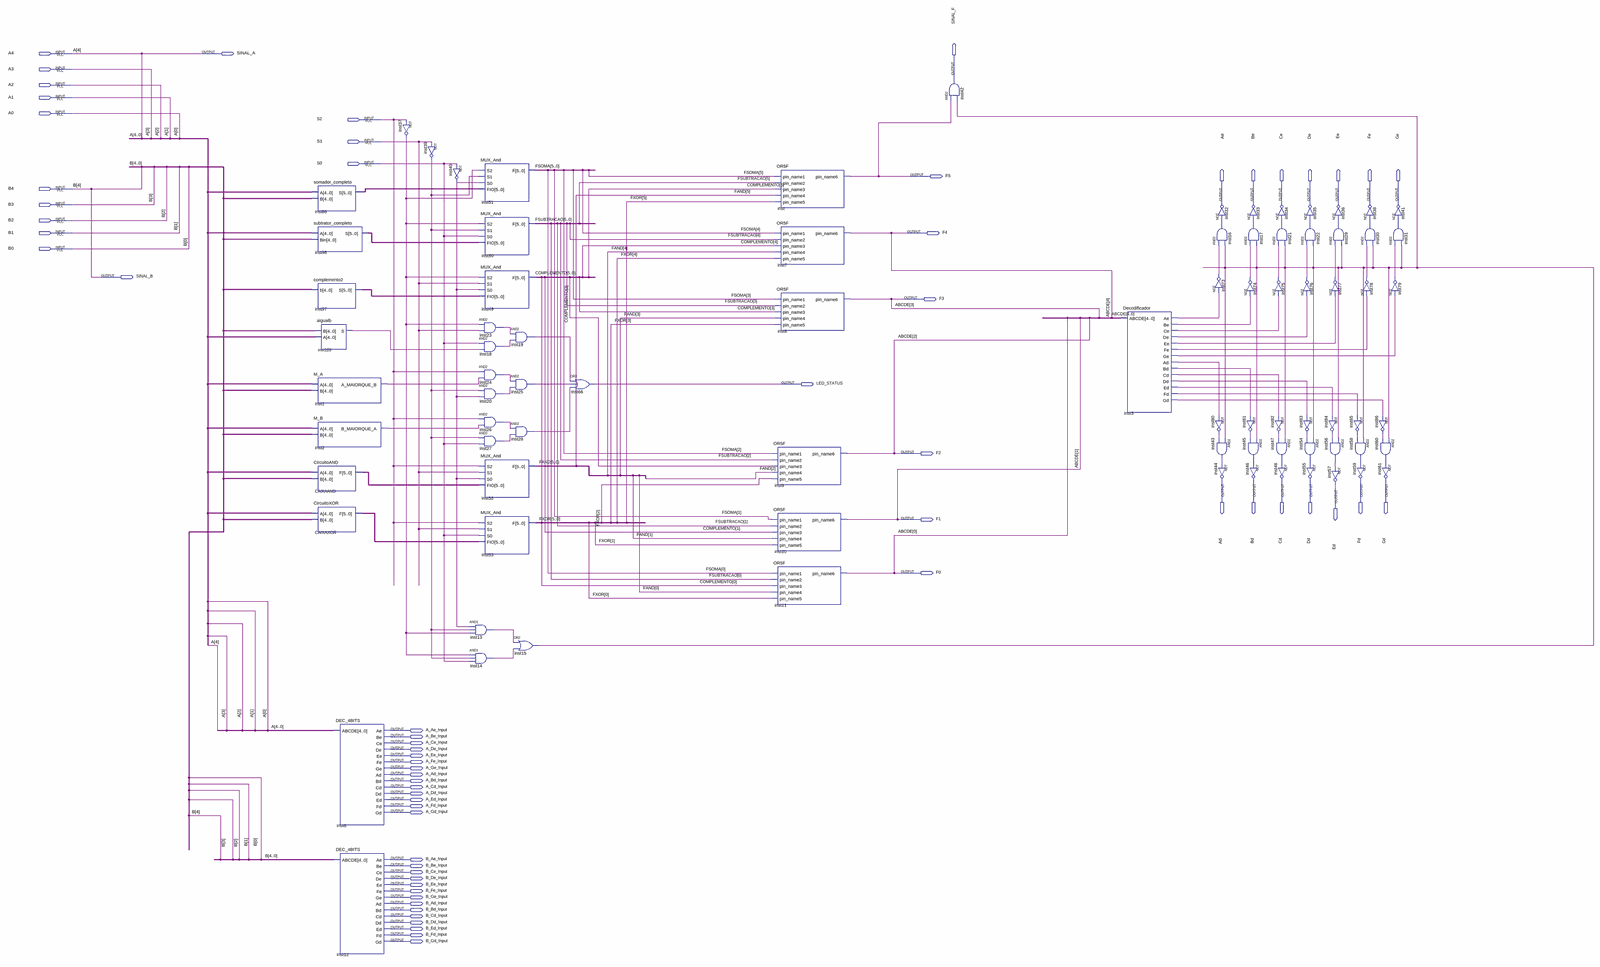
[diagram p0: schematic sheet, whole]
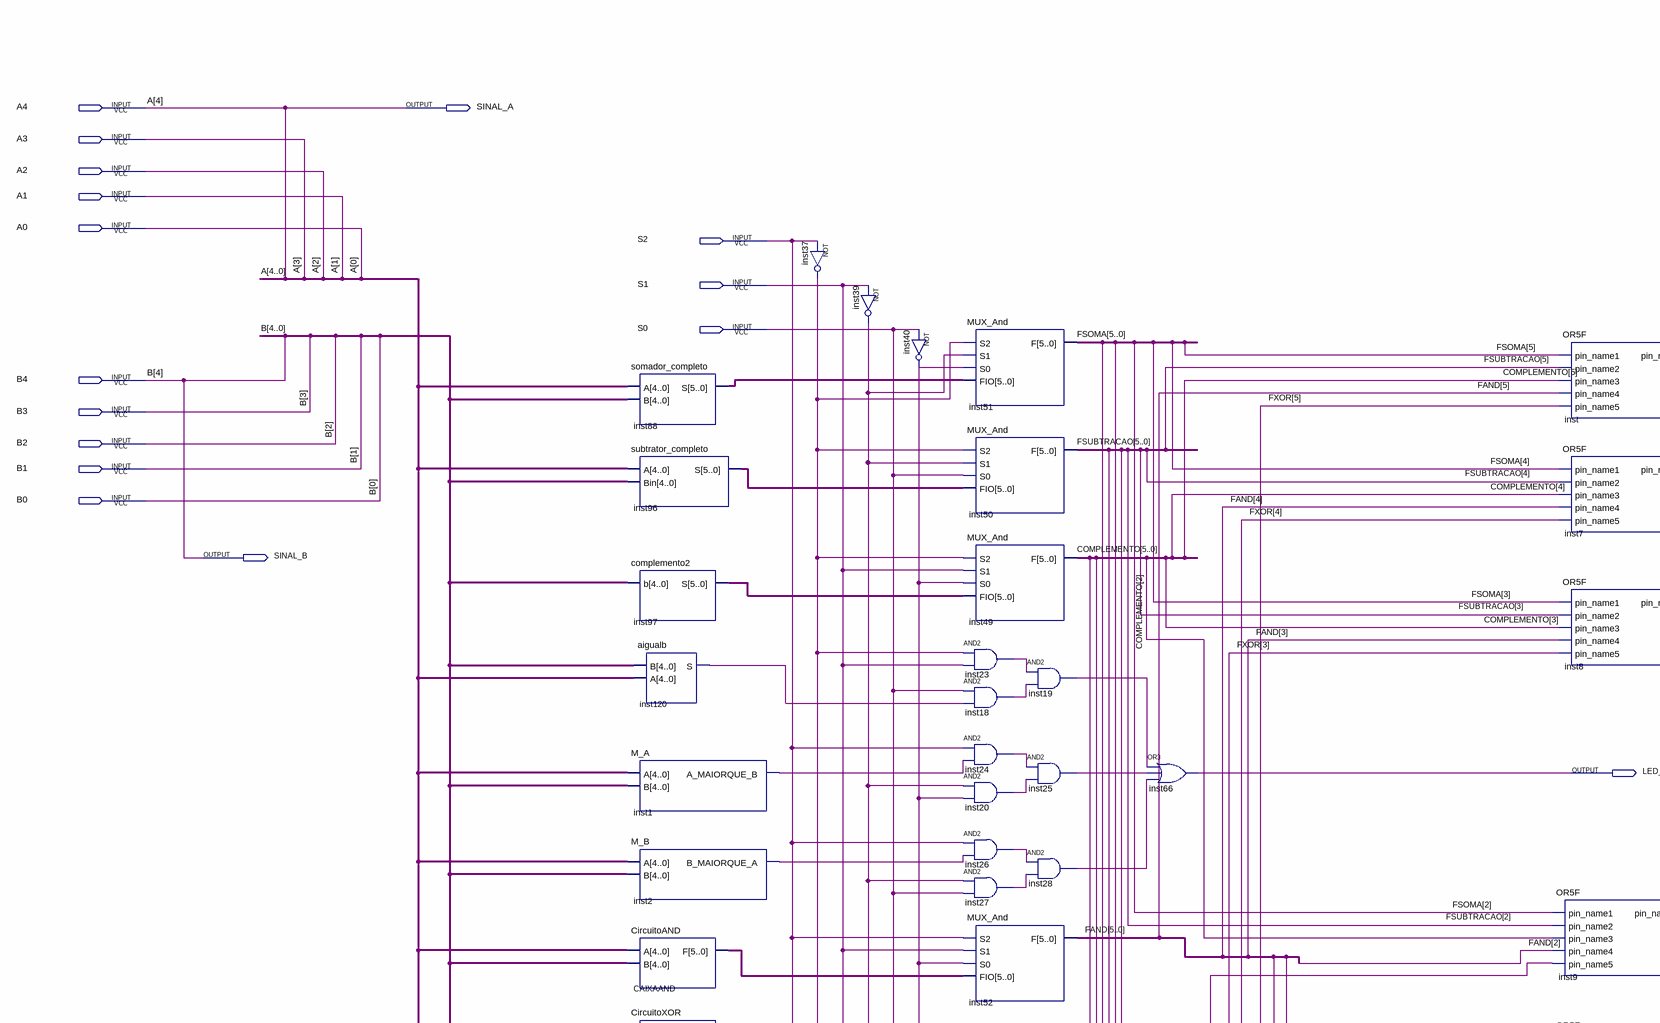
[diagram p1: schematic sheet, upper left part]
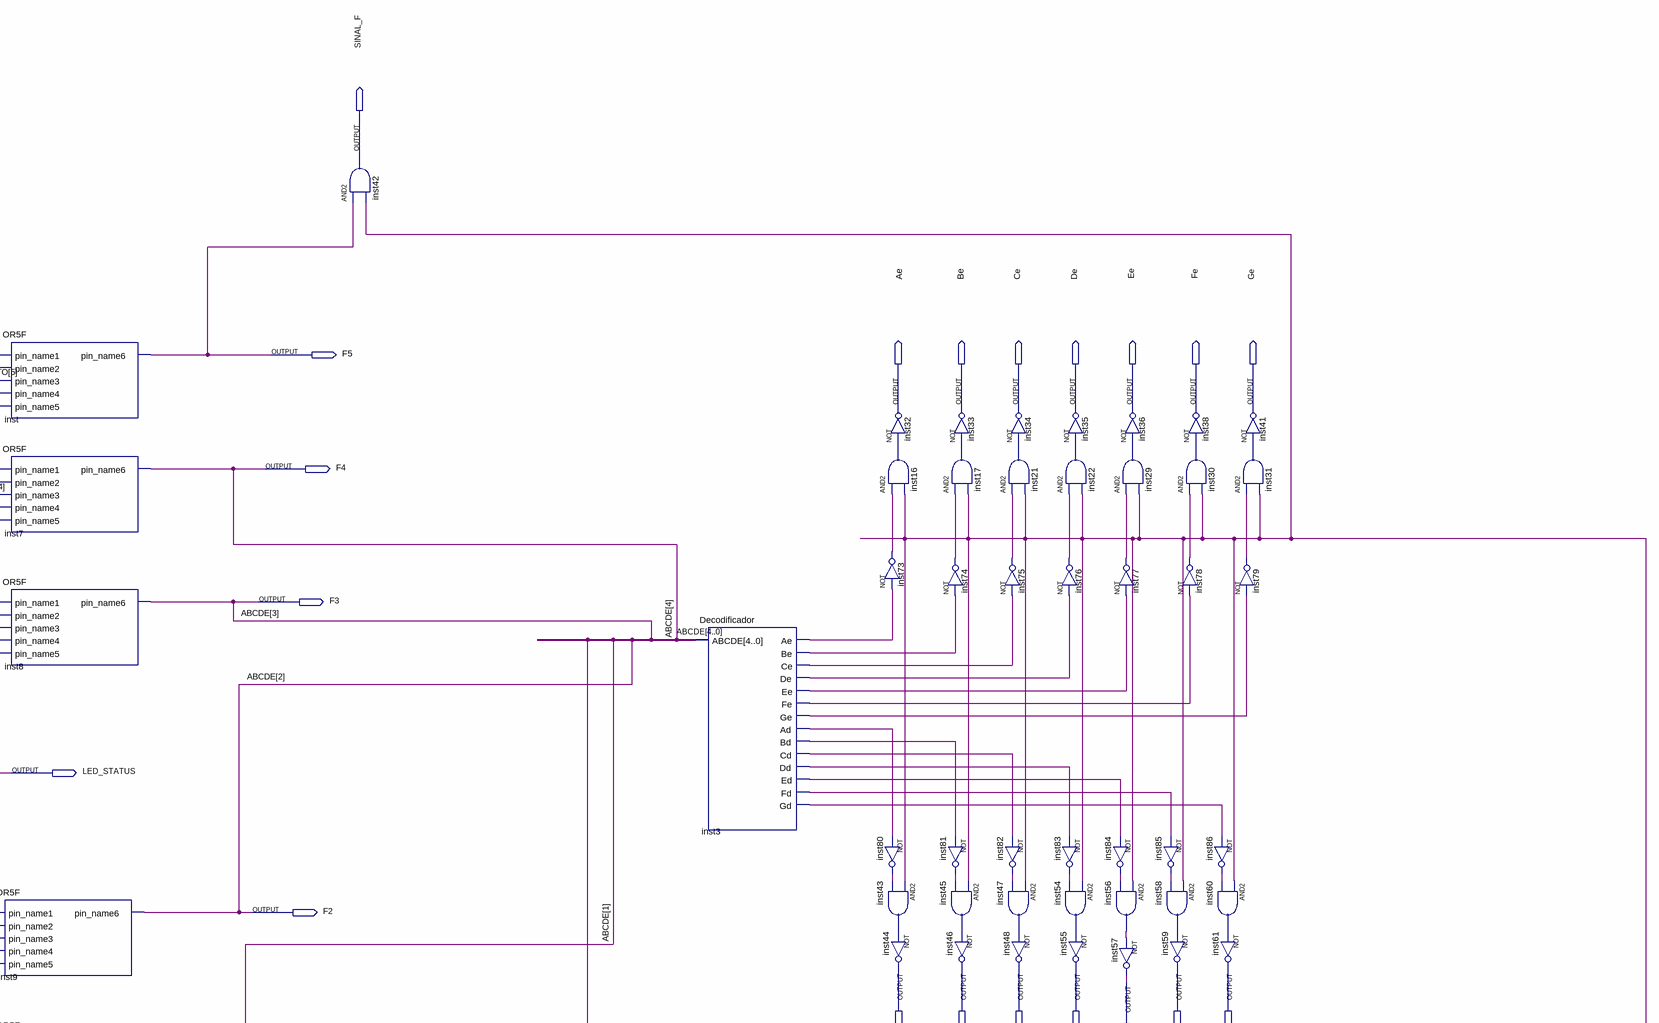
[diagram p2: schematic sheet, upper right part]
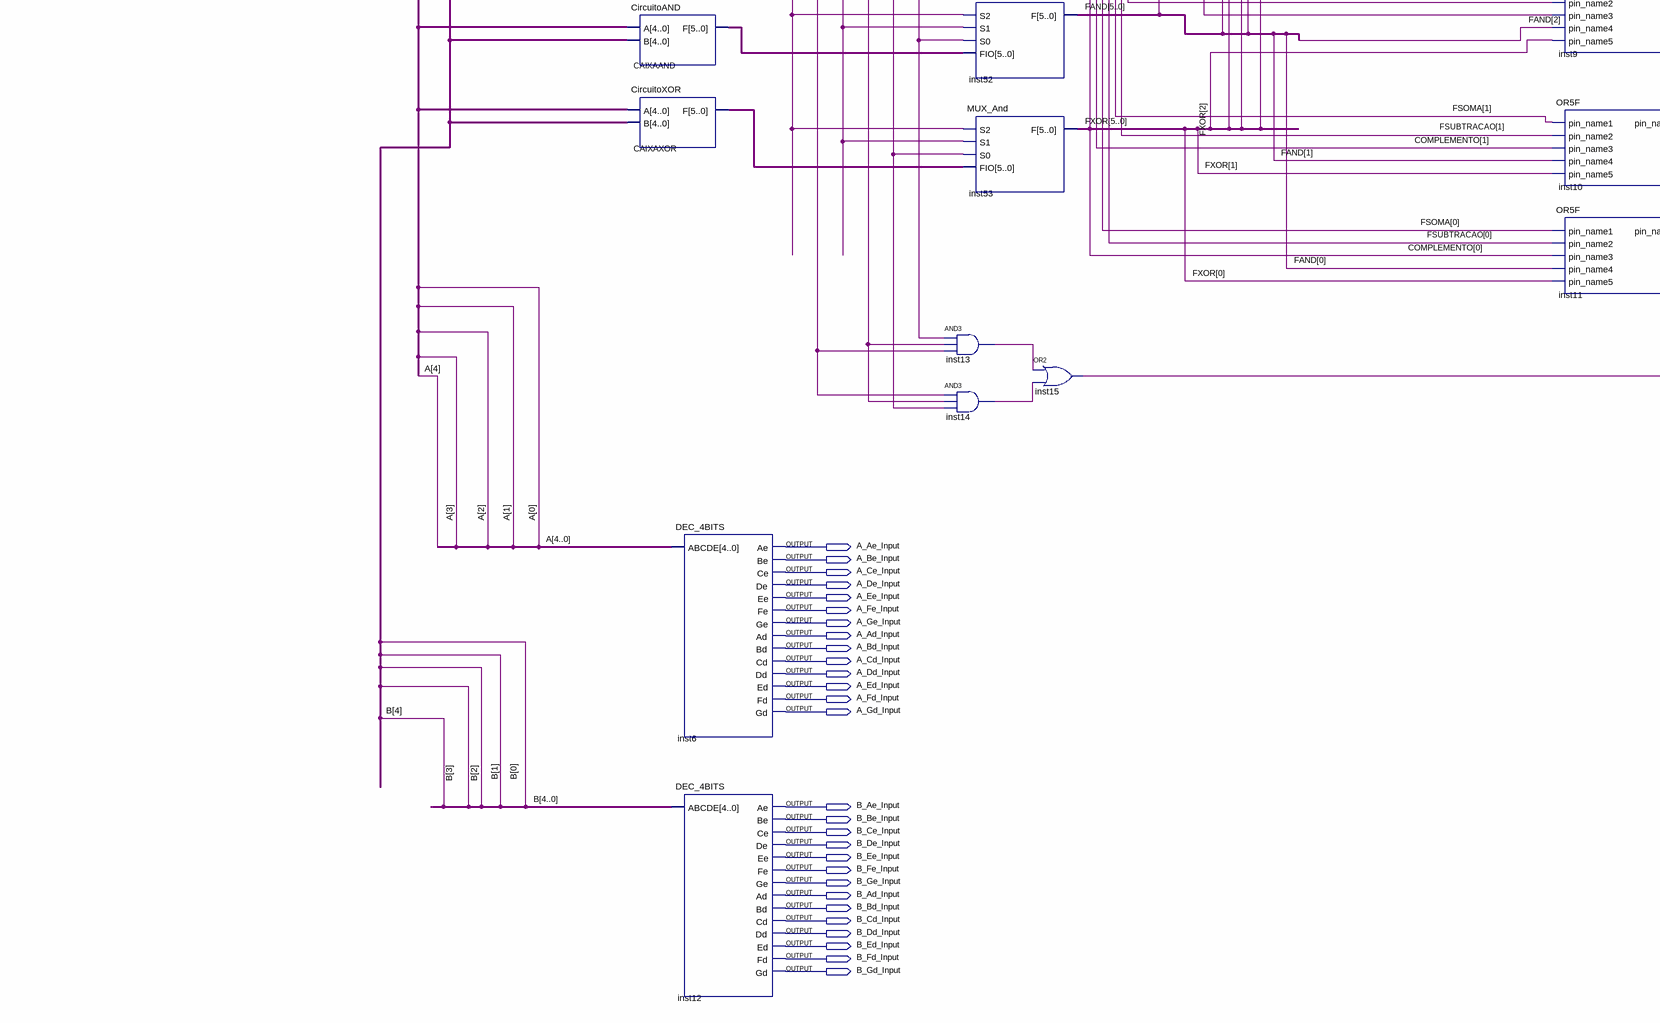
[diagram p3: schematic sheet, lower left part]
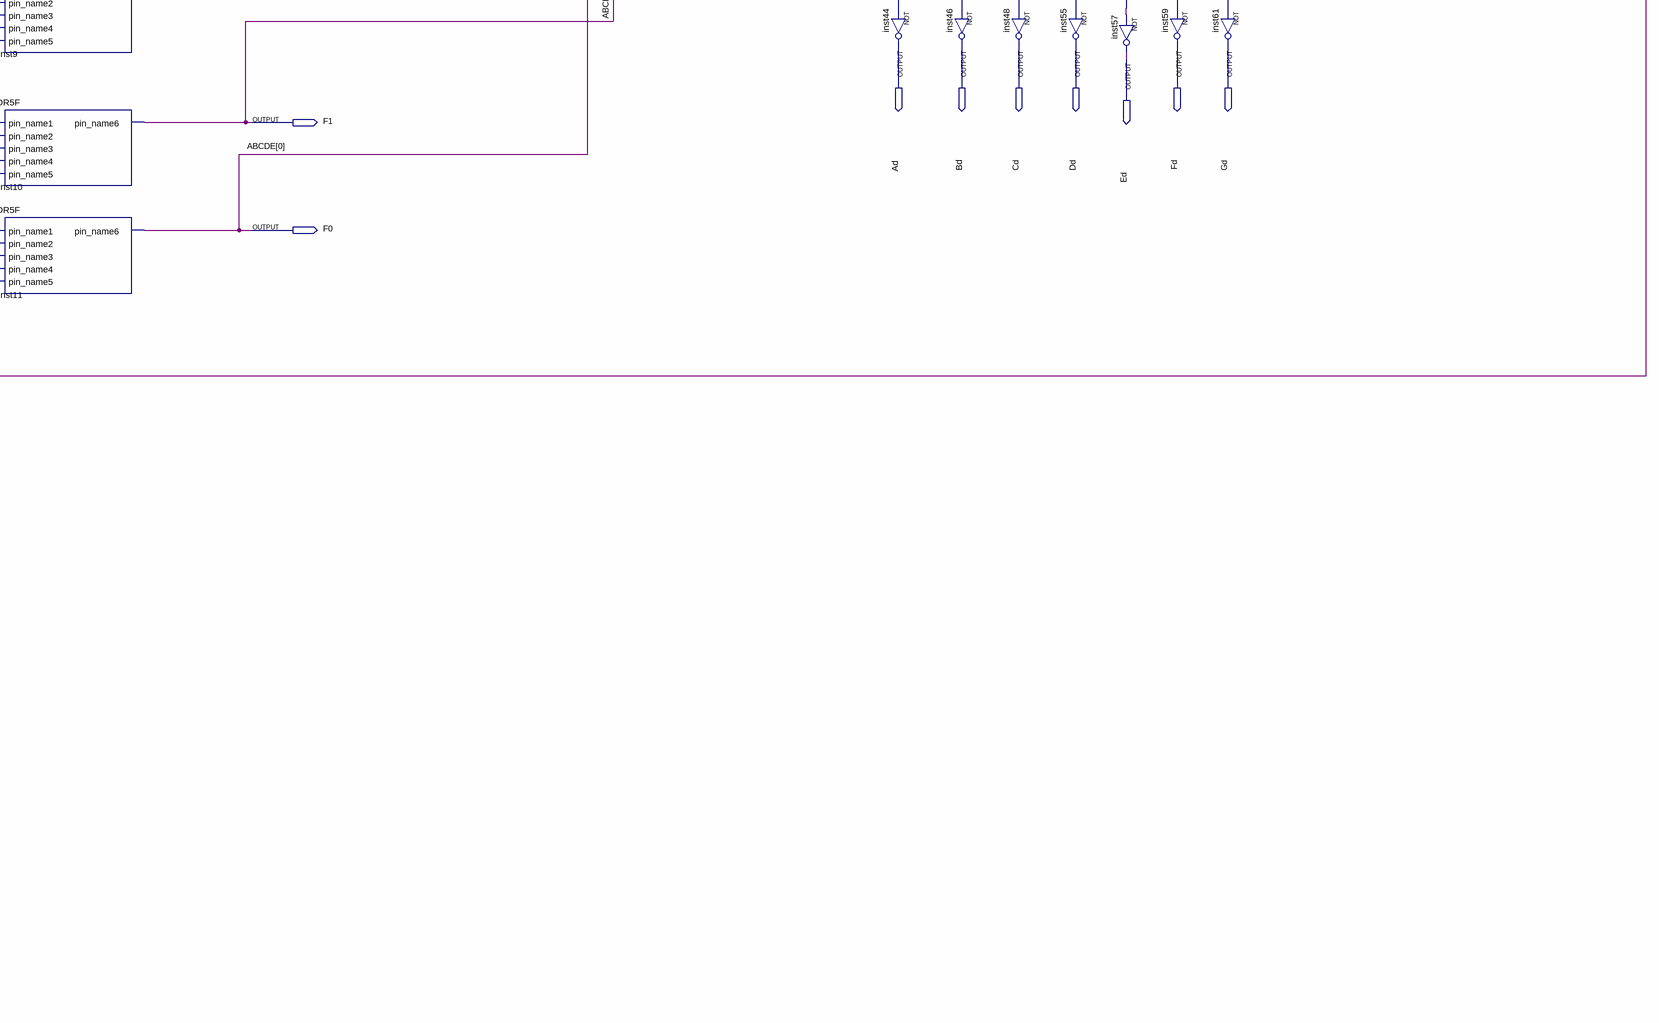
[diagram p4: schematic sheet, lower right part]
// Quartus schematic ProjetoSD1.bdf as structural Verilog: 81 symbols, 65 pins
module ProjetoSD1 (
  input  A4,
  input  A3,
  input  A2,
  input  A1,
  input  A0,
  input  S2,
  input  S1,
  input  S0,
  input  B4,
  input  B3,
  input  B2,
  input  B1,
  input  B0,
  output SINAL_A,
  output SINAL_F,
  output F5,
  output Ae,
  output Be,
  output Ce,
  output De,
  output Ee,
  output Fe,
  output Ge,
  output F4,
  output SINAL_B,
  output F3,
  output LED_STATUS,
  output F2,
  output Ad,
  output Bd,
  output Cd,
  output Dd,
  output Fd,
  output Gd,
  output Ed,
  output F1,
  output F0,
  output A_Ae_Input,
  output A_Be_Input,
  output A_Ce_Input,
  output A_De_Input,
  output A_Ee_Input,
  output A_Fe_Input,
  output A_Ge_Input,
  output A_Ad_Input,
  output A_Bd_Input,
  output A_Cd_Input,
  output A_Dd_Input,
  output A_Ed_Input,
  output A_Fd_Input,
  output A_Gd_Input,
  output B_Ae_Input,
  output B_Be_Input,
  output B_Ce_Input,
  output B_De_Input,
  output B_Ee_Input,
  output B_Fe_Input,
  output B_Ge_Input,
  output B_Ad_Input,
  output B_Bd_Input,
  output B_Cd_Input,
  output B_Dd_Input,
  output B_Ed_Input,
  output B_Fd_Input,
  output B_Gd_Input
);

  wire inst1_a_maiorque_b, inst2_b_maiorque_a, inst3_ad, inst3_ae, inst3_bd, inst3_be, inst3_cd, inst3_ce,
       inst3_dd, inst3_de, inst3_ed, inst3_ee, inst3_fd, inst3_fe, inst3_gd, inst3_ge, inst13_out,
       inst14_out, inst15_out, inst16_out, inst17_out, inst18_out, inst19_out, inst20_out, inst21_out,
       inst22_out, inst23_out, inst24_out, inst25_out, inst26_out, inst27_out, inst28_out, inst29_out,
       inst30_out, inst31_out, inst37_out, inst39_out, inst40_out, inst43_out, inst45_out, inst47_out,
       inst54_out, inst56_out, inst58_out, inst60_out, inst73_out, inst74_out, inst75_out, inst76_out,
       inst77_out, inst78_out, inst79_out, inst80_out, inst81_out, inst82_out, inst83_out, inst84_out,
       inst85_out, inst86_out, inst120_s;
  wire [5:0] CAIXAAND_f, CAIXAXOR_f, COMPLEMENTO, FAND, FSOMA, FSUBTRACAO, FXOR, inst88_s, inst96_s, inst97_s;

  somador_completo inst88 (.A({A4, A3, A2, A1, A0}), .B({B4, B3, B2, B1, B0}), .S(inst88_s));
  subtrator_completo inst96 (.A({A4, A3, A2, A1, A0}), .Bin({B4, B3, B2, B1, B0}), .S(inst96_s));
  complemento2 inst97 (.b({B4, B3, B2, B1, B0}), .S(inst97_s));
  M_A inst1 (.A({A4, A3, A2, A1, A0}), .B({B4, B3, B2, B1, B0}), .A_MAIORQUE_B(inst1_a_maiorque_b));
  M_B inst2 (.A({A4, A3, A2, A1, A0}), .B({B4, B3, B2, B1, B0}), .B_MAIORQUE_A(inst2_b_maiorque_a));
  CircuitoAND CAIXAAND (.A({A4, A3, A2, A1, A0}), .B({B4, B3, B2, B1, B0}), .F(CAIXAAND_f));
  CircuitoXOR CAIXAXOR (.A({A4, A3, A2, A1, A0}), .B({B4, B3, B2, B1, B0}), .F(CAIXAXOR_f));
  aigualb inst120 (.B({B4, B3, B2, B1, B0}), .A({A4, A3, A2, A1, A0}), .S(inst120_s));
  DEC_4BITS inst6 (
    .ABCDE({A4, A3, A2, A1, A0}), .Ae(A_Ae_Input), .Be(A_Be_Input), .Ce(A_Ce_Input), .De(A_De_Input),
    .Ee(A_Ee_Input), .Fe(A_Fe_Input), .Ge(A_Ge_Input), .Ad(A_Ad_Input), .Bd(A_Bd_Input), .Cd(A_Cd_Input),
    .Dd(A_Dd_Input), .Ed(A_Ed_Input), .Fd(A_Fd_Input), .Gd(A_Gd_Input));
  DEC_4BITS inst12 (
    .ABCDE({B4, B3, B2, B1, B0}), .Ae(B_Ae_Input), .Be(B_Be_Input), .Ce(B_Ce_Input), .De(B_De_Input),
    .Ee(B_Ee_Input), .Fe(B_Fe_Input), .Ge(B_Ge_Input), .Ad(B_Ad_Input), .Bd(B_Bd_Input), .Cd(B_Cd_Input),
    .Dd(B_Dd_Input), .Ed(B_Ed_Input), .Fd(B_Fd_Input), .Gd(B_Gd_Input));
  not inst37 (inst37_out, S2);
  not inst39 (inst39_out, S1);
  not inst40 (inst40_out, S0);
  MUX_And inst51 (.S2(inst37_out), .S1(inst39_out), .S0(inst40_out), .FIO(inst88_s), .F(FSOMA));
  MUX_And inst50 (.S2(inst37_out), .S1(inst39_out), .S0(S0), .FIO(inst96_s), .F(FSUBTRACAO));
  MUX_And inst49 (.S2(inst37_out), .S1(S1), .S0(inst40_out), .FIO(inst97_s), .F(COMPLEMENTO));
  and inst23 (inst23_out, inst37_out, S1);
  and inst18 (inst18_out, S0, inst120_s);
  and inst24 (inst24_out, S2, inst1_a_maiorque_b);
  and inst20 (inst20_out, inst39_out, inst40_out);
  and inst26 (inst26_out, S2, inst2_b_maiorque_a);
  and inst27 (inst27_out, inst39_out, S0);
  MUX_And inst52 (.S2(S2), .S1(S1), .S0(inst40_out), .FIO(CAIXAAND_f), .F(FAND));
  MUX_And inst53 (.S2(S2), .S1(S1), .S0(S0), .FIO(CAIXAXOR_f), .F(FXOR));
  and inst13 (inst13_out, inst40_out, inst39_out, inst37_out);
  and inst14 (inst14_out, inst37_out, inst39_out, S0);
  and inst19 (inst19_out, inst23_out, inst18_out);
  and inst25 (inst25_out, inst24_out, inst20_out);
  and inst28 (inst28_out, inst26_out, inst27_out);
  or inst15 (inst15_out, inst13_out, inst14_out);
  or inst66 (LED_STATUS, inst19_out, inst25_out, inst28_out);
  OR5F inst (
    .pin_name1(FSOMA[5]), .pin_name2(FSUBTRACAO[5]), .pin_name3(COMPLEMENTO[5]), .pin_name4(FAND[5]),
    .pin_name5(FXOR[5]), .pin_name6(F5));
  OR5F inst7 (
    .pin_name1(FSOMA[4]), .pin_name2(FSUBTRACAO[4]), .pin_name3(COMPLEMENTO[4]), .pin_name4(FAND[4]),
    .pin_name5(FXOR[4]), .pin_name6(F4));
  OR5F inst8 (
    .pin_name1(FSOMA[3]), .pin_name2(FSUBTRACAO[3]), .pin_name3(COMPLEMENTO[3]), .pin_name4(FAND[3]),
    .pin_name5(FXOR[3]), .pin_name6(F3));
  OR5F inst9 (
    .pin_name1(FSOMA[2]), .pin_name2(FSUBTRACAO[2]), .pin_name3(COMPLEMENTO[2]), .pin_name4(FAND[2]),
    .pin_name5(FXOR[2]), .pin_name6(F2));
  OR5F inst10 (
    .pin_name1(FSOMA[1]), .pin_name2(FSUBTRACAO[1]), .pin_name3(COMPLEMENTO[1]), .pin_name4(FAND[1]),
    .pin_name5(FXOR[1]), .pin_name6(F1));
  OR5F inst11 (
    .pin_name1(FSOMA[0]), .pin_name2(FSUBTRACAO[0]), .pin_name3(COMPLEMENTO[0]), .pin_name4(FAND[0]),
    .pin_name5(FXOR[0]), .pin_name6(F0));
  and inst42 (SINAL_F, F5, inst15_out);
  Decodificador inst3 (
    .ABCDE({F4, F3, F2, F1, F0}), .Ae(inst3_ae), .Be(inst3_be), .Ce(inst3_ce), .De(inst3_de), .Ee(inst3_ee),
    .Fe(inst3_fe), .Ge(inst3_ge), .Ad(inst3_ad), .Bd(inst3_bd), .Cd(inst3_cd), .Dd(inst3_dd), .Ed(inst3_ed),
    .Fd(inst3_fd), .Gd(inst3_gd));
  not inst32 (Ae, inst16_out);
  and inst16 (inst16_out, inst73_out, inst15_out);
  not inst73 (inst73_out, inst3_ae);
  not inst80 (inst80_out, inst3_ad);
  and inst43 (inst43_out, inst15_out, inst80_out);
  not inst44 (Ad, inst43_out);
  and inst17 (inst17_out, inst74_out, inst15_out);
  not inst74 (inst74_out, inst3_be);
  not inst81 (inst81_out, inst3_bd);
  and inst45 (inst45_out, inst15_out, inst81_out);
  not inst33 (Be, inst17_out);
  not inst46 (Bd, inst45_out);
  not inst34 (Ce, inst21_out);
  and inst21 (inst21_out, inst75_out, inst15_out);
  not inst75 (inst75_out, inst3_ce);
  not inst82 (inst82_out, inst3_cd);
  and inst47 (inst47_out, inst15_out, inst82_out);
  not inst48 (Cd, inst47_out);
  not inst35 (De, inst22_out);
  and inst22 (inst22_out, inst76_out, inst15_out);
  not inst76 (inst76_out, inst3_de);
  not inst83 (inst83_out, inst3_dd);
  and inst54 (inst54_out, inst15_out, inst83_out);
  not inst55 (Dd, inst54_out);
  not inst36 (Ee, inst29_out);
  and inst29 (inst29_out, inst77_out, inst15_out);
  not inst77 (inst77_out, inst3_ee);
  not inst84 (inst84_out, inst3_ed);
  and inst56 (inst56_out, inst15_out, inst84_out);
  not inst57 (Ed, inst56_out);
  not inst38 (Fe, inst30_out);
  and inst30 (inst30_out, inst78_out, inst15_out);
  not inst78 (inst78_out, inst3_fe);
  not inst85 (inst85_out, inst3_fd);
  and inst58 (inst58_out, inst15_out, inst85_out);
  not inst59 (Fd, inst58_out);
  not inst41 (Ge, inst31_out);
  and inst31 (inst31_out, inst79_out, inst15_out);
  not inst79 (inst79_out, inst3_ge);
  not inst86 (inst86_out, inst3_gd);
  and inst60 (inst60_out, inst15_out, inst86_out);
  not inst61 (Gd, inst60_out);

  assign SINAL_A = A4;
  assign SINAL_B = B4;

  // Other names for the same wires on the sheet: ABCDE[4:0] = {F4, F3, F2, F1, F0}
endmodule
